# EAGLE design 311_lora_es920_faboblocks_Rev020001 (EAGLE 9.6.2)
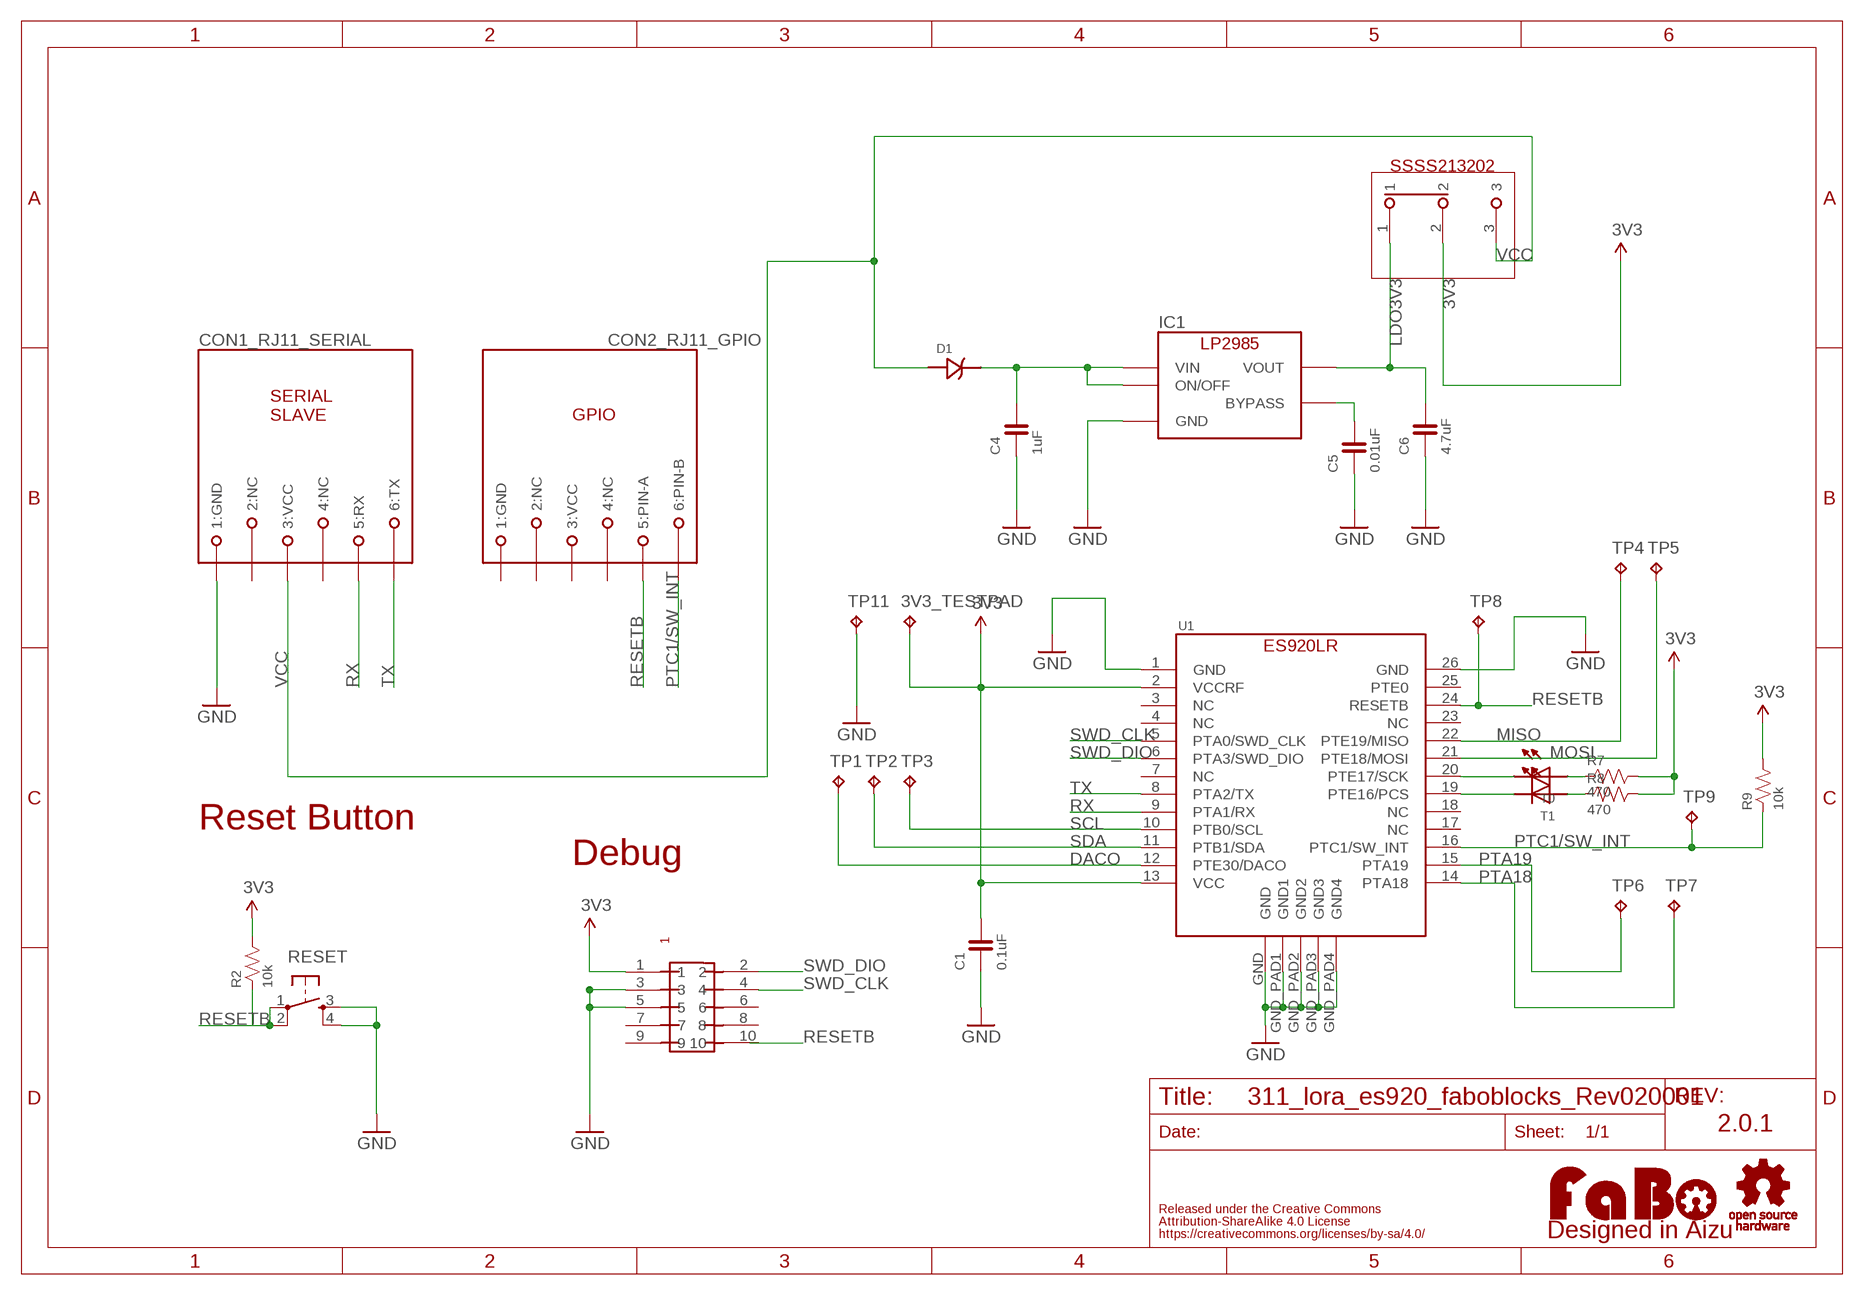
[diagram p0: schematic, sheet 1]

## Parts
3V3_TESTPAD  TPTP20R  [TP20R]
C1  0.1uF  CAPACITOR-0603_NARROW  [0603-NARROW]
C4  1uF  CAPACITOR-0603_NARROW  [0603-NARROW]
C5  0.01uF  CAPACITOR-0603_NARROW  [0603-NARROW]
C6  4.7uF  CAPACITOR-0603_NARROW  [0603-NARROW]
CON1_RJ11_SERIAL  MODULAR-JACK-6P-RJ11_SERIAL_S  [7002-6PXC-X]
CON2_RJ11_GPIO  MODULAR-JACK-6P-RJ11_GPIO  [7002-6PXC-X]
D1  CUS05F40  [CUS05F40]
IC1  LP2985-33DBV  [SOT-23-5]
LOGO1  LOGO_FABO-M_BOTTOM  [LOGO_FABO_M_BOTTOM]
R2  10k  RESISTOR-0603-NARROW  [0603-NARROW]
R7  470  RESISTOR-0603-NARROW  [0603-NARROW]
R8  470  RESISTOR-0603-NARROW  [0603-NARROW]
R9  10k  RESISTOR-0603-NARROW  [0603-NARROW]
RESET  TACT-SWITCH-SMD_KMR2  [KMR2]
T0  LED-0603  [0603]
T1  LED-0603  [0603]
TP1  TPTP20R  [TP20R]
TP2  TPB1,27  [B1,27]
TP3  TPTP20R  [TP20R]
TP4  TPTP20R  [TP20R]
TP5  TPTP20R  [TP20R]
TP6  TPTP20R  [TP20R]
TP7  TPTP20R  [TP20R]
TP8  TPTP20R  [TP20R]
TP9  TPTP20R  [TP20R]
TP11  TPTP20R  [TP20R]
U1  ES920LR  [ES920LR]
U$3  LOGO_OSHW-M_BOTTOM  [LOGO_OSHW_M_BOTTOM]
U$5  SSSS213202  [SSSS213202]
U$8  PIN-HEADER-SMT(1.27MM)2X5  [PIN-HEADER-SMT(1.27MM)2X5]

## Nets
3V3: 3V3_TESTPAD.TP C1.2 R2.2 R7.2 R8.2 R9.2 U1.2(VCCRF) U1.13(VCC) U$5.2 U$8.1
DACO: TP1.TP U1.12(PTE30/DACO)
GND: C1.1 C4.1 C5.1 C6.1 CON1_RJ11_SERIAL.1(1:GND) IC1.2(GND) RESET.3 RESET.4 TP11.TP U1.1(GND) U1.26(GND) U1.GND U1.GND_PAD1(GND1) U1.GND_PAD2(GND2) U1.GND_PAD3(GND3) U1.GND_PAD4(GND4) U$8.3 U$8.5
LDO3V3: C6.2 IC1.5(VOUT) U$5.1
MISO: TP4.TP U1.22(PTE19/MISO)
MOSI: TP5.TP U1.21(PTE18/MOSI)
N$3: T1.CATHODE U1.19(PTE16/PCS)
N$4: T0.CATHODE U1.20(PTE17/SCK)
N$5: R7.1 T0.ANODE
N$6: R8.1 T1.ANODE
N$9: C5.2 IC1.4(BYPASS)
N$17: C4.2 D1.C(CATHODE) IC1.1(VIN) IC1.3(ON/OFF)
PTA18: TP7.TP U1.14(PTA18)
PTA19: TP6.TP U1.15(PTA19)
PTC1/SW_INT: CON2_RJ11_GPIO.6(6:PIN-B) R9.1 TP9.TP U1.16(PTC1/SW_INT)
RESETB: CON2_RJ11_GPIO.5(5:PIN-A) R2.1 RESET.1 RESET.2 TP8.TP U1.24(RESETB) U$8.10
RX: CON1_RJ11_SERIAL.5(5:RX) U1.9(PTA1/RX)
SCL: TP3.TP U1.10(PTB0/SCL)
SDA: TP2.TP U1.11(PTB1/SDA)
SWD_CLK: U1.5(PTA0/SWD_CLK) U$8.4
SWD_DIO: U1.6(PTA3/SWD_DIO) U$8.2
TX: CON1_RJ11_SERIAL.6(6:TX) U1.8(PTA2/TX)
VCC: CON1_RJ11_SERIAL.3(3:VCC) D1.A(ANODE) U$5.3
Unconnected: CON1_RJ11_SERIAL.2(2:NC) CON1_RJ11_SERIAL.4(4:NC) CON2_RJ11_GPIO.2(2:NC) CON2_RJ11_GPIO.4(4:NC) U1.3(NC) U1.4(NC) U1.7(NC) U1.17(NC) U1.18(NC) U1.23(NC) U1.25(PTE0) U$8.6 U$8.7 U$8.8 U$8.9

## Notes on the sheet
- SSSS213202
- Reset Button
- Debug
- 2.0.1

## Power pins joined to a net without a drawn wire
1:GND: CON2_RJ11_GPIO.1(1:GND)
3:VCC: CON2_RJ11_GPIO.3(3:VCC)

## Library data of the parts
3V3_TESTPAD TP1-TP9 TP11 = testpad:TP: Test pad
C1 C4-C6 = FaBo-Capacitor:CAPACITOR: CAPACITOR
CON1_RJ11_SERIAL = FaBo-Connetor:MODULAR-JACK-6P-RJ11_SERIAL_S
CON2_RJ11_GPIO = FaBo-Connetor:MODULAR-JACK-6P-RJ11_GPIO
D1 = FaBo-Diode:CUS05F40
IC1 = FaBo-Supply:LP2985: LP2985
LOGO1 = component:LOGO_FABO
R2 R7-R9 = FaBo-Resistors:RESISTOR: RESISTOR
RESET = FaBo-Switch:TACT-SWITCH
T0 T1 = FaBo-LED:LED
U1 = FaBo-LoRa:ES920LR
U$3 = component:LOGO_OSHW
U$5 = FaBo-Switch:SSSS213202
U$8 = GClue:PIN-HEADER-SMT(1.27MM)2X5: PIN-HEADER-SMT (1.27MM) 2x5

## Board
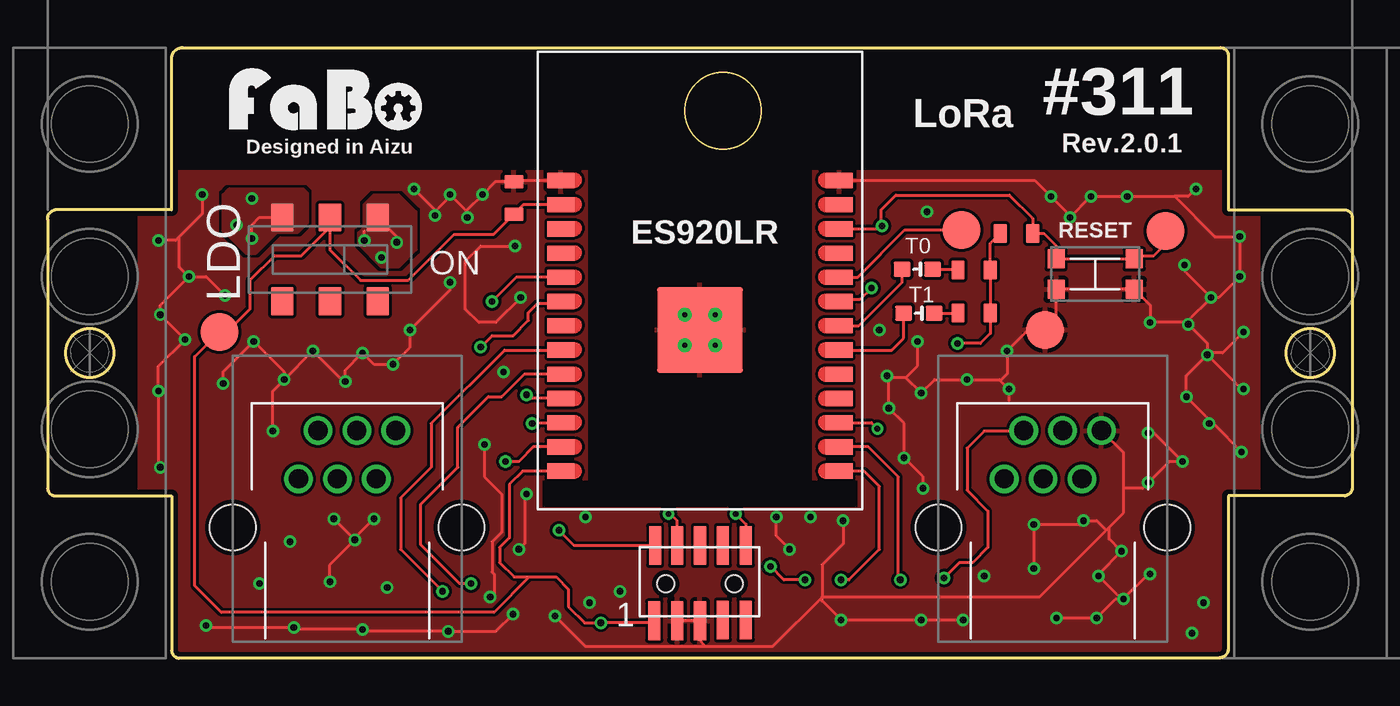
[diagram p1: board, top side]
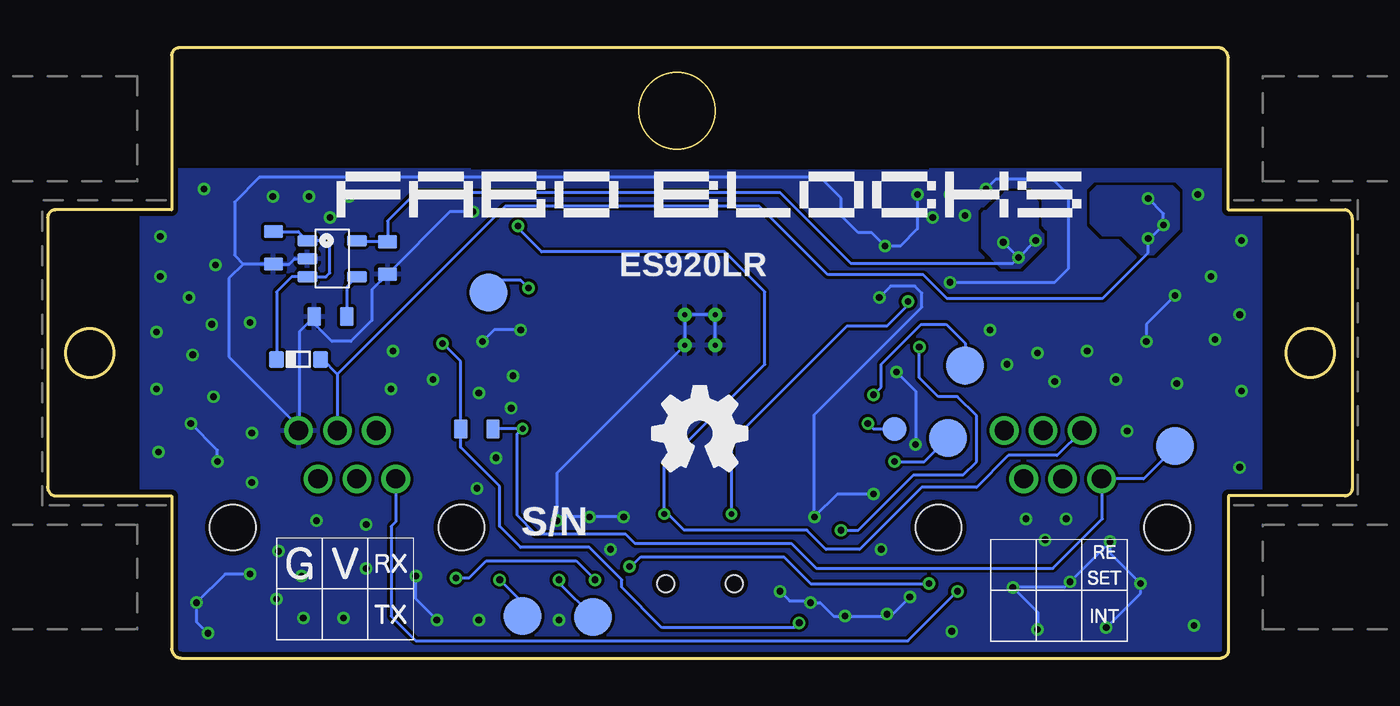
[diagram p2: board, bottom side, seen from below]

Size 68.41 x 32 mm. Coordinates in mm from the lower left corner, seen from the top.
Outline: 7.1,32 61.5,32 arc-90 61.9,31.6 61.9,23.5 68,23.5 arc-90 68.4,23.1 68.4,9 arc-90 68,8.5 61.9,8.5 61.9,0.5 arc-90 61.4,0 6.9,0 arc-90 6.5,0.4 6.5,8.5 0.4,8.5 arc-90 0,8.9 0,23 arc-90 0.4,23.5 6.5,23.5 6.5,31.5 arc-90 7.1,32
Outline: circle at 66.2,16 radius 1.27
Outline: circle at 2.2,16 radius 1.27
Copper layers (1*16): Top 0.035mm / dielectric 1.6mm / Bottom 0.035mm
Design rules "PCBway": minimum track width 6mil, minimum drill 12mil, track to track 6mil, track to pad 6mil, pad to pad 6mil, via to via 6mil, smd to smd 6mil, copper to edge 10mil, drill to drill 10mil, minimum pad ring 10mil, minimum via ring 6mil, stop-mask expansion 2mil, vias tented up to drill 100mil, thermal gap 8mil
tRestrict: area -0.3,25.6 to 71.7,36.6; area -1.2,7.3 to 4.7,24.4; area 63.6,7.5 to 69.5,24.6
bRestrict: area -0.1,25.7 to 71.9,36.7; area -1.2,7.3 to 4.7,24.4; area 63.6,7.6 to 69.5,24.7

### Footprints (pad centres in the part's own frame; a part is rotated, then mirrored left to right if it is on the bottom)
TP20R = smd 2 x 2: TP 0,0
0603-NARROW = smd 0.71 x 1: 1 -0.85,0; 2 0.85,0
7002-6PXC-X = drill 1: 1 2.55,5.08; 2 1.53,2.54; 3 0.51,5.08; 4 -0.51,2.54; 5 -1.53,5.08; 6 -2.55,2.54 | hole 2.4: -6,0; 6,0
CUS05F40 = smd 0.8 x 0.9: A -1.15,0; C 1.15,0
SOT-23-5 = smd 0.6 x 1.05: 1 -0.95,-1.3; 2 0,-1.3; 3 0.95,-1.3; 4 0.95,1.3; 5 -0.95,1.3
KMR2 = smd 0.9 x 1: 1 -2.05,0.8; 2 2.05,0.8; 3 2.05,-0.8; 4 -2.05,-0.8
0603 = smd 0.9 x 0.8: ANODE -0.8,0; CATHODE 0.8,0
B1,27 = smd 1.27 x 1.27: TP 0,0
ES920LR = smd 1.4 x 0.8: 1 -7.3,5.24; 2 -7.3,3.97; 3 -7.3,2.7; 4 -7.3,1.43; 5 -7.3,0.16; 6 -7.3,-1.11; 7 -7.3,-2.38; 8 -7.3,-3.65; 9 -7.3,-4.92; 10 -7.3,-6.19; 11 -7.3,-7.46; 12 -7.3,-8.73; 13 -7.3,-10; 14 7.3,-10; 15 7.3,-8.73; 16 7.3,-7.46; 17 7.3,-6.19; 18 7.3,-4.92; 19 7.3,-3.65; 20 7.3,-2.38; 21 7.3,0.16; 22 7.3,-1.11; 23 7.3,1.43; 24 7.3,2.7; 25 7.3,3.97; 26 7.3,5.24 | smd 4.5 x 4.5: GND 0,-2.6 | drill 0.25: GND_PAD1 -0.8,-1.8; GND_PAD2 0.8,-1.8; GND_PAD3 -0.8,-3.4; GND_PAD4 0.8,-3.4
SSSS213202 = smd 1.2 x 1.5: 1 -2.5,-2.2; 2 0,-2.2; 3 2.5,-2.2; 4 2.5,2.2; 5 0,2.2; 6 -2.5,2.2
PIN-HEADER-SMT(1.27MM)2X5 = smd 0.635 x 2.032: 1 -2.4,-1.95; 2 -2.35,2; 3 -1.2,-1.95; 4 -1.2,2; 5 0,-1.95; 6 0,2; 7 1.2,-1.9; 8 1.2,2; 9 2.4,-1.9; 10 2.4,2 | hole 0.9: 1.8,0; -1.8,0

### Placement (x,y rotation side)
3V3_TESTPAD  9,17.1 0 top
C1  24.44,24.12 270 top
C4  56.57,21.51 90 bottom
C5  53.57,17.9 0 bottom
C6  50.58,20.98 90 bottom
CON1_RJ11_SERIAL  52.7,6.85 0 top
CON2_RJ11_GPIO  15.7,6.85 0 top
D1  55.26,15.66 180 bottom
IC1  53.49,20.94 270 bottom
LOGO1  14.57,27.3 0 bottom
R2  50.8,22.27 180 top
R7  48.58,20.35 0 top
R8  48.58,18.09 0 top
R9  45.9,12 180 bottom
RESET  54.92,20.13 0 top
T0  45.6,20.38 180 top
T1  45.68,18.07 180 top
TP1  21.21,11.53 0 bottom
TP2  24,12 0 bottom
TP3  20.31,15.34 0 bottom
TP4  45.3,19.17 0 bottom
TP5  47.91,22.45 0 top
TP6  43.51,2.2 0 bottom
TP7  39.81,2.15 0 bottom
TP8  58.6,22.4 0 top
TP9  9.3,11.11 0 bottom
TP11  52.3,17.2 0 top
U1  34.2,19.8 0 top
U$2  [4-1BLOCK]  2.2,16 0 top
U$3  34.2,11.78 0 top
U$4  [4-1BLOCK]  66.2,16 180 top
U$5  14.8,20.9 180 top
U$8  34.2,3.9 0 top

### Tracks (layer width: path | path; a pad name or v marks a point on that pad's centre or on a via)
3V3  (via drill 0.35)
  Top 0.152: 49.45,20.32 R7.2 | R7.2 49.43,21.75 R2.2 | U1.2 24.95,23.77 C1.2 23.38,22.2 21.3,22.2 18.9,19.8 16.4,19.8 14.8,21.4 U$5.2 14.8,22.6 13.3,21.1 11.9,21.1 10.6,19.8 10.6,18.3 9.4,17.1 3V3_TESTPAD.TP 7.7,15.8 7.7,3.8 9.1,2.4 23.4,2.4 25.25,4.25 | v47.7,16.5 48.9,16.5 49.43,17.02 R8.2 R7.2 | U$8.1 31.7,1.85 v29,1.85 28.15,1.85 27.3,2.7 27.3,3.6 26.65,4.25 25.25,4.25 | U1.13 24.9,9.8 24.2,9.1 24.2,6.3 23.7,5.8 23.7,5 24.45,4.25 25.25,4.25
  Bottom 0.152: v29,1.85 29.25,1.6 36.2,1.6 38.3,3.7 38.3,4.1 40,5.8 43.6,5.8 44.7,6.9 44.7,9 46.75,11.05 R9.2 46.75,15.55 v47.7,16.5
DACO  (via drill 0.35)
  Top 0.152: U1.12 25.47,11.07 24.7,10.3 v24,10.3
  Bottom 0.152: v24,10.3 22.43,10.3 TP1.TP
GND  (via drill 0.35)
  Top 0.152: U$8.5 34.1,1.95 | 34.1,1.95 U$8.3 | U1.1 24.52,25.04 C1.1 23.47,24.97 v22.8,24.3 22,23.5 v22,23.1 22,23.4 v21.1,24.3 21.1,24.2 20.3,23.4 | v41.7,7.2 41.7,6 40.6,4.9 40.6,3.2 | 40.6,3.2 38,0.6 34.5,0.6 | 34.5,0.6 34.1,1 34.1,1.95 | CON1_RJ11_SERIAL.1 56.4,10.78 56.4,8.9 | 40.6,3.2 52,3.2 55.5,6.7 | 56.4,8.9 56.4,7.6 55.65,6.85 | 55.65,6.85 55.5,6.7 | v24.8,18.9 23.5,17.6 22.6,17.6 21.9,18.3 21.9,20.8 22.7,21.6 v24.5,21.6 | U1.GND U1.GND_PAD3 | v24.7,5.7 25,6 25,8.5 v25.1,8.6 | v26.6,2.2 28.2,0.6 34.5,0.6 | v24.4,2.3 23.5,1.4 v21,1.4 16.6,1.4 v16.5,1.5 13,1.5 v12.9,1.6 8.4,1.6 v8.3,1.7 | v8.1,24.3 8.1,23.3 6.9,22.1 | v5.8,21.9 6.7,21.9 6.9,22.1 | v7.4,20 6.9,20.5 6.9,22.1 | v7.4,20 5.9,18.5 v5.9,18 v7.2,16.7 5.8,15.3 v5.8,14 5.8,10.1 v5.9,10 | v7.4,20 8.3,20 v9.3,19 | v9.2,14.4 9.2,15 v10.8,16.6 12.4,15 v12.4,14.6 | v12.4,14.6 v13.9,16.1 15.5,14.5 v15.6,14.5 15.6,15.1 v16.5,16 17.1,15.4 v18.1,15.4 19,16.3 v19,17.2 21.1,19.3 v21.1,19.7 | v19.2,24.6 20.3,23.5 20.3,23.4 | 20.3,23.4 v20.3,23.2 | v11.8,11.9 11.8,14 v12.4,14.6 | v14.8,4 14.8,4.9 v16.1,6.2 | v16.1,6.2 v15,7.3 | v16.1,6.2 16.1,6.3 v17.1,7.3 | v61,18.9 61.4,18.9 v62.5,20 v62.5,22.1 61.2,22.1 59.1,24.2 | v61,18.9 59.6,20.3 v59.6,20.6 | v59.8,17.5 59.8,17.7 v61,18.9 | v59.8,17.5 59.7,17.6 v57.8,17.6 57.8,18.5 RESET.3 RESET.4 52.87,17.77 TP11.TP 51.4,17.2 v50.3,16.1 50.3,14.9 49.95,14.55 | v59.8,17.5 60.8,16.5 60.8,16 | 60.8,16 v60.8,15.9 | v62.7,17.1 61.6,16 60.8,16 | v60.8,15.9 62.6,14.1 v62.7,14.1 | v60.8,15.9 59.7,14.8 v59.7,13.7 60.9,12.5 v60.9,12.3 61.1,12.3 v62.6,10.8 | v57.7,11.8 58,11.8 v59.5,10.3 58.8,10.3 v57.7,9.2 57.4,8.9 56.4,8.9
  Top 0.152: v56.4,3.1 56.3,3.1 v55.1,4.3 55.1,4.4 v56.3,5.6 55.65,6.25 55.65,6.85 | v56.4,3.1 57.7,4.4 v57.8,4.4 | 55.5,6.7 55,7.2 v54.3,7.2 54.1,7 v51.7,7 v51.7,4.7 | v45.9,8.9 45.9,9.5 v44.9,10.5 44.9,12.3 v44.1,13.1 44.1,14.7 | 44.1,14.7 v44,14.8 | 45,14.7 v45.8,13.9 46.5,14.6 v48.2,14.6 49.9,14.6 49.95,14.55 | 45,14.7 44.1,14.7 | 49.95,14.55 v50.4,14.1 50.4,13.5 | v45.6,16.6 45.6,15.3 45,14.7 | v38.9,5.7 38.2,6.4 v38.2,7.4 | 59.1,24.2 v56.6,24.2 v54.7,24.2 v53.6,23.1 53.6,23.2 v52.6,24.2 51.76,25.04 U1.26 | v60.2,24.6 59.8,24.2 59.1,24.2 | v22.9,11.2 22.9,9.5 23.8,8.6 23.8,6.6 23.3,6.1 23.3,4.5 23.4,4.4 23.4,3.4 v23.2,3.2 | 40.6,3.2 40.6,3 v41.6,2 v45.8,2 v48,2 | v52.9,2.1 v55,2.1 56,3.1 v56.4,3.1
  Bottom 0.152: U1.GND_PAD3 U1.GND_PAD1 U1.GND_PAD2 U1.GND_PAD4 41.7,9.7 v41.7,7.2 41.5,7.4 v40,7.4 v38.2,7.4 | C5.1 54.56,17.76 | 54.56,17.76 55.2,17.12 55.2,12.1 | CON1_RJ11_SERIAL.1 55.2,11.98 55.2,12.1 | IC1.2 55.46,20.94 55.74,20.66 C4.1 58.14,20.66 | 58.14,20.66 58.9,19.9 58.9,15.8 55.2,12.1 | 54.56,17.76 54.56,17.66 53.5,16.6 52.5,16.6 51.4,17.7 51.4,19.31 C6.1 47.31,23.4 v46.1,23.4 | 58.14,20.66 58.6,21.12 58.6,23.9 57.3,25.2 27.9,25.2 26.8,24.1 26.8,23.2 25.9,22.3 25.2,22.3 v24.5,21.6 23.7,21.6 22.8,22.5 v22.8,24.3 | v30,3.5 29.5,3 28.5,3 v28.4,2.9 27.9,2.9 27.2,2.2 v26.6,2.2 24.5,2.2 v24.4,2.3 24.1,2.3 v23.2,3.2 | v24.8,18.9 24.2,19.5 22.93,19.5 22.57,19.13 22.57,18.4 28.2,12.77 v28.2,7.4 27,8.6 v25.1,8.6 | v9.3,19 10.8,17.5 v10.8,16.6 | v21.1,19.7 15.6,19.7 14.9,20.4 14.9,24.3 15.7,25.1 18.7,25.1 v19.2,24.6 | v12.9,1.6 11.1,3.4 v11.1,3.9 12.7,5.5 v12.7,6.1 v14.8,4 15.1,3.7 v17.8,3.7 16.5,2.4 v16.5,1.5 | v43.6,17.2 45,17.2 v45.6,16.6 | v57.8,4.4 59.1,4.4 v60.6,2.9 60.6,1.9 v60,1.3 | v59.5,10.3 59.5,10.9 v60.9,12.3 | v23.9,15 22.9,14 v22.9,11.2 | v48,2 49.1,3.1 v49.1,4.3
  pour Bottom (rank 6): -12.1,-5.1 96.3,-5.1 96.3,40 -12.1,40
  pour Top (rank 6): -9.2,-2.7 88.3,-2.7 88.3,37.3 -9.2,37.3
LDO3V3  (via drill 0.35)
  Top 0.152: v16.6,21.9 16.6,22.4 | U$5.1 18.3,22.1 v18.3,21.8
  Bottom 0.152: v17.5,21 17.8,20.7 26.3,20.7 30,24.4 49.1,24.4 50.58,22.92 C6.2 52.13,21.83 IC1.5 | v17.5,21 v18.3,21.8 | v17.5,21 v16.6,21.9
  pour Top (no thermals): 17.5,20.5 16.3,21.7 16.3,22.3 16.6,22.6 16.6,23.8 17.1,24.3 18.4,24.3 19.3,23.4 19.3,21.4 18.4,20.5
  pour Bottom (no thermals): 16.2,21.7 16.2,22.2 16.5,22.5 16.5,23.9 17,24.4 18.2,24.4 19.2,23.4 19.3,23.4 19.4,23.3 19.4,21.5 18.4,20.5 17.4,20.5
MISO  (via drill 0.35)
  Top 0.152: U1.22 41.61,18.8 42.6,18.8 v43.2,19.4
  Bottom 0.152: v43.2,19.4 43.6,19.8 44.6,19.8 45.23,19.17 TP4.TP
MOSI
  Top 0.152: U1.21 42.46,19.96 44.95,22.45 TP5.TP
N$3
  Top 0.152: U1.19 44.25,16.15 44.88,16.77 T1.CATHODE
N$4
  Top 0.152: T0.CATHODE 44.8,19.7 42.5,17.4 41.52,17.4 U1.20
N$5
  Top 0.152: T0.ANODE 47.69,20.38 R7.1
N$6
  Top 0.152: T1.ANODE 47.72,18.07 R8.1
N$9
  Bottom 0.152: IC1.4 52.72,19.46 C5.2
N$17
  Bottom 0.152: D1.C 56.41,19.2 55.61,19.99 IC1.3 53.81,19.99 53.6,20.2 53.6,21.6 53.89,21.89 IC1.1 55.26,22.36 C4.2
PTA18  (via drill 0.35)
  Top 0.152: v41.6,4.1 42,4.1 43.6,5.7 43.6,9 42.8,9.8 U1.14
  Bottom 0.152: v41.6,4.1 41.6,3.95 TP7.TP
PTA19  (via drill 0.35)
  Top 0.152: v44.7,4.1 44.6,4.2 44.6,9.5 43.03,11.07 U1.15
  Bottom 0.152: v44.7,4.1 43.51,2.9 TP6.TP
PTC1/SW_INT  (via drill 0.3)
  Top 0.152: 43.48,12 v43.5,12.03 43.19,12.34 U1.16
  Bottom 0.152: R9.1 45.03,12.03 v43.5,12.03 43.8,11.72 43.8,7.5 42.8,6.5 38.1,6.5 37.6,6 29.4,6 28.1,4.7 15.7,4.7 13.1,7.3 13.1,9.39 | TP9.TP 9.3,11.03 10.94,9.39 13.1,9.39 | 13.1,9.39 CON2_RJ11_GPIO.6
RESETB  (via drill 0.3, 0.35)
  Top 0.152: TP8.TP 58.6,22.3 58.6,21.7 58,21.1 57.14,21.1 RESET.2 RESET.1 | RESET.1 52.87,21.63 52.24,22.27 R2.1 51.65,23.05 50.43,24.27 44.48,24.27 43.7,23.5 43.7,22.7 v43.75,22.65 43.6,22.5 U1.24 | 52.94,21 RESET.1 | U$8.10 36.6,7.03 v36.08,7.55
  Bottom 0.152: v43.75,22.65 43.75,22.55 42.5,21.3 32.9,21.3 30.8,19.2 30.8,15.4 36.08,10.12 v36.08,7.55 35.88,7.55 35.03,6.7 28.6,6.7 27.6,5.7 25.83,5.7 22.58,8.95 19.7,8.95 18.03,10.62 15.48,10.62 CON2_RJ11_GPIO.5
RX  (via drill 0.35)
  Top 0.152: CON1_RJ11_SERIAL.5 51.14,11.9 49.1,11.9 48.2,11 48.2,8.8 49.3,7.7 49.3,5.8 48.5,5 47.8,5 v47,4.2 | v39.7,4.1 38.6,4.1 v37.9,4.8 | v22.2,3.9 21.6,3.9 19.57,5.93 19.57,8.07 21.5,10 21.5,12.1 23.1,13.7 23.8,13.7 25,14.9 26.88,14.9 U1.9
  Bottom 0.152: v47,4.2 46.3,4.2 45.4,5.1 40.7,5.1 v39.7,4.1 | v37.9,4.8 37.8,4.8 37.3,5.3 29.8,5.3 28.4,3.9 v22.2,3.9
SCL  (via drill 0.35)
  Top 0.152: U1.10 25.29,13.61 v25.1,13.8
  Bottom 0.152: v25.1,13.8 24.7,14.2 24.7,15.4 22.6,17.5 21.3,17.5 20.31,16.5 TP3.TP
SDA  (via drill 0.35)
  Top 0.152: U1.11 26.86,12.3 v25.4,12.3
  Bottom 0.152: TP2.TP 25.1,12 v25.4,12.3
SWD_CLK  (via drill 0.3, 0.35)
  Top 0.152: U1.5 24.56,19.96 v23.3,18.7 | U$8.4 33,7.2 32.65,7.55 v32.55,7.55
  Bottom 0.152: v23.3,18.7 23.3,18.5 24.4,17.4 26.5,17.4 32.55,11.35 v32.55,7.55
SWD_DIO  (via drill 0.35)
  Top 0.152: U1.6 26.81,18.6 25.7,18.6 25.2,18.1 25.2,17.7 24.4,16.9 23.3,16.9 v22.7,16.3 | U$8.2 27.6,5.9 v26.8,6.7
  Bottom 0.152: v22.7,16.3 22.7,14.7 21.7,13.7 20.7,13.7 19.7,12.7 19.7,10.3 20.4,9.6 23,9.6 25.9,6.7 v26.8,6.7
TX  (via drill 0.35)
  Top 0.152: U1.8 23.95,16.15 20.1,12.3 20.1,10 18.5,8.4 18.5,5.7 v20.7,3.5
  Bottom 0.152: CON1_RJ11_SERIAL.6 50.15,7.15 50.4,6.9 50.4,2.2 49.1,0.9 23.3,0.9 v20.7,3.5
VCC  (via drill 0.35)
  Top 0.152: v10.7,22 10.7,22.7 11.1,23.1 U$5.3
  Bottom 0.152: 53.21,14.89 CON1_RJ11_SERIAL.3 | 53.21,14.89 44.4,23.7 31.1,23.7 27.5,20.1 22.5,20.1 21.28,18.88 13.08,18.88 10.7,21.25 v10.7,22 10.6,22 v9.9,22.7 9.9,23.3 v10.7,24.1 | 53.21,14.89 53.98,15.66 D1.A
  pour Top (no thermals): 9.2,22.4 9.2,24.3 9.5,24.6 13.4,24.6 13.6,24.4 13.6,22.8 13.1,22.3 12,22.3 10.9,21.2 10.4,21.2
  pour Bottom (no thermals): 9.1,22.5 9.1,24.4 9.4,24.7 13.4,24.7 13.7,24.4 13.7,22.8 13.1,22.2 12.1,22.2 11.1,21.2 10.4,21.2

### Text on the board
tPlace: LoRa | #311 | Rev.2.0.1 | Designed in Aizu | ES920LR | ON | LDO
bPlace: ES920LR | S/N
Document: LoRa #311 ES920 FaBo BLOKS Rev2.0.1 / 2022/07/19 Fix